# Altium schematic sheet RP2040.SchDoc
size A3; SheetNumber: 1; SheetTotal: 3
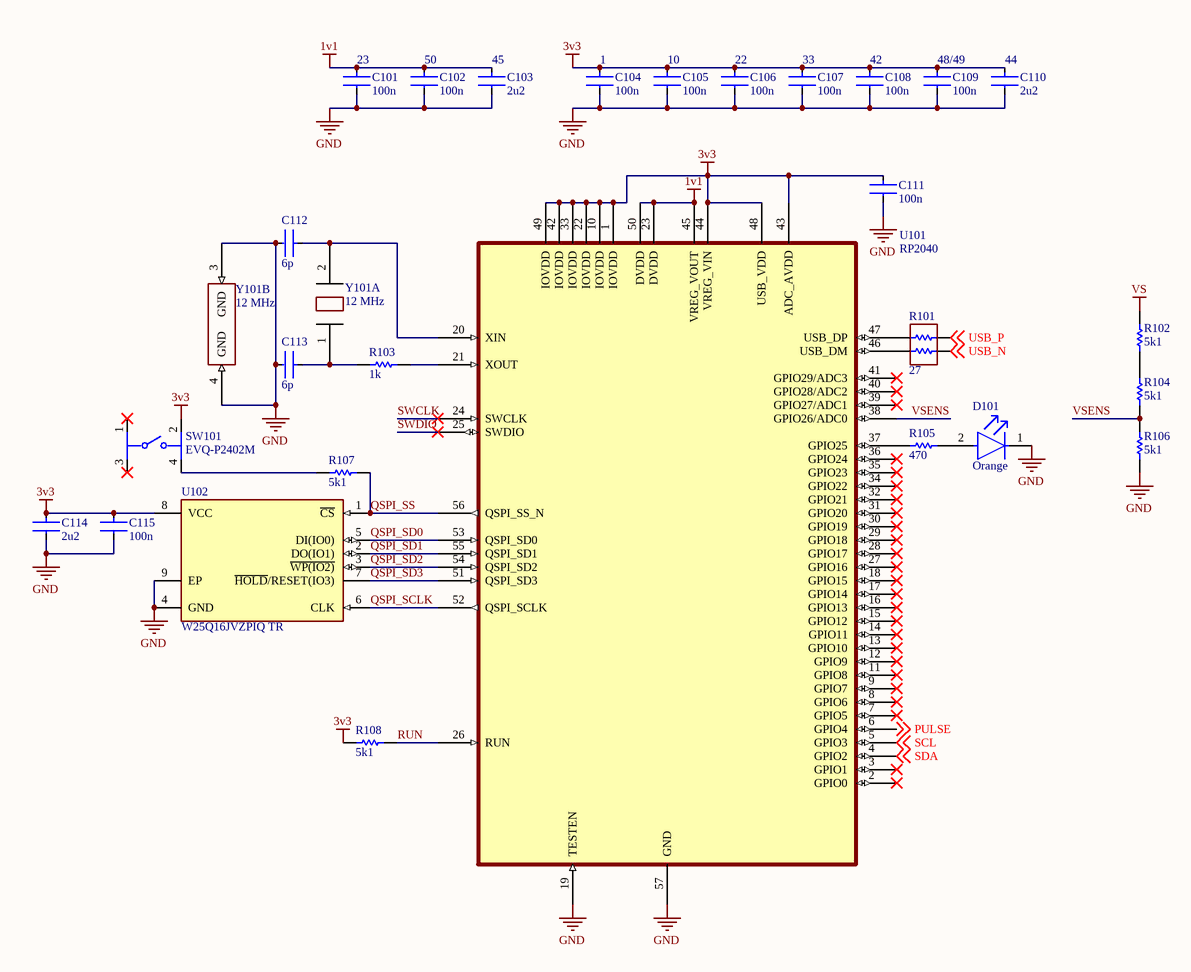
[diagram p0: RP2040.SchDoc]

## Parts
C101  100n  [FP-GCM155-0_05-MFG]
C102  100n  [FP-GCM155-0_05-MFG]
C103  2u2  [CAPC1608X10N]
C104  100n  [FP-GCM155-0_05-MFG]
C105  100n  [FP-GCM155-0_05-MFG]
C106  100n  [FP-GCM155-0_05-MFG]
C107  100n  [FP-GCM155-0_05-MFG]
C108  100n  [FP-GCM155-0_05-MFG]
C109  100n  [FP-GCM155-0_05-MFG]
C110  2u2  [CAPC1608X10N]
C111  100n  [FP-GCM155-0_05-MFG]
C112  6p  [FP-GCQ155-0_05-MFG]
C113  6p  [FP-GCQ155-0_05-MFG]
C114  2u2  [CAPC1608X10N]
C115  100n  [FP-GCM155-0_05-MFG]
D101  Orange  [FP-SML-P1-MFG]
R101  27  [CAC-65P100X100-4L]
R102  5k1  [RESC1005X04N]
R103  1k  [RESC1005X04N]
R104  5k1  [RESC1005X04N]
R105  470  [RESC1005X04N]
R106  5k1  [RESC1005X04N]
R107  5k1  [RESC1005X04N]
R108  5k1  [RESC1005X04N]
SW101  EVQ-P2402M  [EVQ-P2402M]
U101  RP2040  [QFN40P700X700X90_HS-57N]
U102  W25Q16JVZPIQ TR  [WSON-8]
Y101  12 MHz  [XTAL_ABRACON_ABM10]  (parts A,B of 2)

## Nets
1v1: C101.1 C102.1 C103.1 U101.23(DVDD) U101.45(VREG_VOUT) U101.50(DVDD)
3v3: C104.1 C105.1 C106.1 C107.1 C108.1 C109.1 C110.1 C111.1 C114.1 C115.1 R108.1 SW101.2 U101.1(IOVDD) U101.10(IOVDD) U101.22(IOVDD) U101.33(IOVDD) U101.42(IOVDD) U101.43(ADC_AVDD) U101.44(VREG_VIN) U101.48(USB_VDD) U101.49(IOVDD) U102.8(VCC)
GND: C101.2 C102.2 C103.2 C104.2 C105.2 C106.2 C107.2 C108.2 C109.2 C110.2 C111.2 C112.2 C113.2 C114.2 C115.2 D101.1(C) R106.1 U101.19(TESTEN) U101.57(GND) U102.4(GND) U102.9(EP) Y101.3(GND) Y101.4(GND)
VS: R102.2
PULSE: U101.6(GPIO4) ; off-sheet PULSE
QSPI_SCLK: U101.52(QSPI_SCLK) U102.6(CLK)
QSPI_SD0: U101.53(QSPI_SD0) U102.5(DI(IO0))
QSPI_SD1: U101.55(QSPI_SD1) U102.2(DO(IO1))
QSPI_SD2: U101.54(QSPI_SD2) U102.3(~{WP(IO2)})
QSPI_SD3: U101.51(QSPI_SD3) U102.7(~{HOLD}/RESET(IO3))
QSPI_SS: R107.2 U101.56(QSPI_SS_N) U102.1(~{CS})
RUN: R108.2 U101.26(RUN)
SCL: U101.5(GPIO3) ; off-sheet SCL
SDA: U101.4(GPIO2) ; off-sheet SDA
SWCLK: U101.24(SWCLK)
SWDIO: U101.25(SWDIO)
USB_N: R101.3 ; off-sheet USB_N
USB_P: R101.4 ; off-sheet USB_P
VSENS: R104.1 R106.2 U101.38(GPIO26/ADC0)
NetC112_1: C112.1 U101.20(XIN) Y101.2
NetC113_1: C113.1 R103.1 Y101.1
NetD101_2: D101.2(A) R105.2
NetR101_1: R101.1 U101.47(USB_DP)
NetR101_2: R101.2 U101.46(USB_DM)
NetR102_1: R102.1 R104.2
NetR103_2: R103.2 U101.21(XOUT)
NetR105_1: R105.1 U101.37(GPIO25)
NetR107_1: R107.1 SW101.4

Not connected (* = marked no-connect by the designer): SW101 1* 3*; U101 2(GPIO0)* 3(GPIO1)* 7(GPIO5)* 8(GPIO6)* 9(GPIO7)* 11(GPIO8)* 12(GPIO9)* 13(GPIO10)* 14(GPIO11)* 15(GPIO12)* 16(GPIO13)* 17(GPIO14)* 18(GPIO15)* 27(GPIO16)* 28(GPIO17)* 29(GPIO18)* 30(GPIO19)* 31(GPIO20)* 32(GPIO21)* 34(GPIO22)* 35(GPIO23)* 36(GPIO24)* 39(GPIO27/ADC1)* 40(GPIO28/ADC2)* 41(GPIO29/ADC3)*

## Notes on the sheet
- (near C101) 23
- (near C102) 50
- (near C103) 45
- (near C104) 1
- (near C105) 10
- (near C106) 22
- (near C107) 33
- (near C108) 42
- (near C109) 48/49
- (near C110) 44

## Library data of the parts
C101 C102 C104-C109 C111 C115 = GCM155R71H104KE02J: Ceramic Capacitor for Automotive 100nF ±10% 50VDC X7R 0402 Paper T/R; Voltage Rating (DC): 50V; Case Code (Metric): 1005; Dielectric: X7R; Capacitance: 100nF; Packaging: Tape and Reel; Min Operating Temperature: -55°C; Length: 0.039inch; Thickness: 0.022inch; Height: 0.5mm; Mount: Surface Mount; Termination: SMD/SMT; Voltage Rating: 50V; Package Quantity: 50000; Width: 0.02inch; Case/Package: 0402; Case Code (Imperial): 0402; Ratings: AEC-Q200; Max Operating Temperature: 125°C; Tolerance: 10%; Weight: 0.000212oz; Supplier 1: Digi-Key; Supplier Part Number 1: 490-14514-1-ND
C103 C110 C114 = GRT188R61H225ME13D: Multilayer Ceramic Capacitors MLCC - SMD/SMT 0603 50Vdc 2.2uF X5R 20%; Supplier 1: Future Electronics; Supplier Part Number 1: 5087209
C112 C113 = GCQ1555C1H6R0BB01D: High Q Ceramic Capacitor for Automotive 6pF ±0.1pF 50VDC C0G 0402 Paper T/R; Voltage Rating: 50V; Max Operating Temperature: 125°C; Capacitance: 6pF; Case Code (Imperial): 0402; Min Operating Temperature: -55°C; Case/Package: 0402; Mount: Surface Mount; Case Code (Metric): 1005; Ratings: AEC-Q200; Packaging: Tape and Reel; Supplier 1: Digi-Key; Supplier Part Number 1: 490-17493-1-ND
D101 = SML-P11DTT86R: LED ORANGE CLEAR 1006 SMD; Manufacturer: Rohm; Forward Current: 1mA; Wavelength: 605nm; Reverse Voltage: 5V; Power Dissipation: 52mW; Led Orientation: Top View; Luminous Intensity: 7.3mcd; Forward Voltage: 1.9V; Mouser Description: LED Uni-Color Orange 2-Pin Chip 0402(1006Metric) T/R; RoHS: TRUE; Temperature: -40°C to +85°C; Package: SML-P11; Manufacturer Part Number: SML-P11DTT86R; Automotive: No; Digikey Description: LED ORANGE CLEAR 1006 SMD; Lead Free: Yes; Octopart: https://octopart.com/sml-p11dtt86r-rohm-34112313; Temperature Range Low: -40°C; Device Class L2: LEDs; Device Class L3: unset; Height: 0.25mm; Temperature Range High: +85°C; Device Class L1: Optoelectronics; ComponentLink2URL: https://d1d2qsbl8m0m72.cloudfront.net/en/products/databook/datasheet/opto/led/chip_mono/sml-p11-e.pdf; Colour: Orange; Category: Diode; ComponentLink2Description: Datasheet; Supplier 1: Digi-Key; Supplier Part Number 1: SML-P11DTT86RCT-ND
R101 = EXB-24V270JX: Supplier 1: Digi-Key; Supplier Part Number 1: Y5270CT-ND
R102 R104 R106-R108 = ERJ-U02J512X: Manufacturer: Panasonic; Part Number: ERJ2RKF27R0X; Supplier 1: Mouser; Supplier Part Number 1: 667-ERJ-U02J512X
R103 = ERJ-2GEJ102X: Manufacturer: Panasonic; Part Number: ERJ-2GEJ102X; Supplier 1: Newark; Supplier Part Number 1: 65T8247
R105 = ERJ-U02J471X: Manufacturer: Panasonic; Part Number: ERJ2RKF27R0X; Supplier 1: Digi-Key; Supplier Part Number 1: 10-ERJ-U02J471XCT-ND
U102 = W25Q16JVZPIQ TR: IC FLASH 16M SPI 133MHZ 8WSON; Memory Type: Non-Volatile; Memory Size: 16Mb; Max Operating Temperature: 85°C; Min Operating Temperature: -40°C; Frequency: 133MHz; Mount: Surface Mount; Packaging: Tape and Reel; Supplier 1: Digi-Key; Supplier Part Number 1: W25Q16JVZPIQCT-ND
Y101 = ABM10-166-12.000MHZ-T3: Supplier 1: Newark; Supplier Part Number 1: 51AC8104
SW101 = EVQ-P2402M: Supplier 1: Digi-Key; Supplier Part Number 1: P11080SCT-ND
U101 = RP2040: Supplier 1: Newark; Supplier Part Number 1: 49AJ8739